# Altium schematic sheet S04-INTERFACES.SchDoc
size B; SheetNumber: 5; SheetTotal: 7; BLOCK-TITLE: RADIO/AUDIO MODULE INTERFACES; BLOCK-SIZE: B; BLOCK-PROJECT: MULTIMOD BASE; BLOCK-REVISION: 1; BLOCK-ORGANIZATION: UNIVERSITY OF FLORIDA; BLOCK-DESIGNER: MEHRON TALEBI; BLOCK-IDENTIFIER: SUMMER 2023; BLOCK-REVIEWER: MIKE STAPLETON
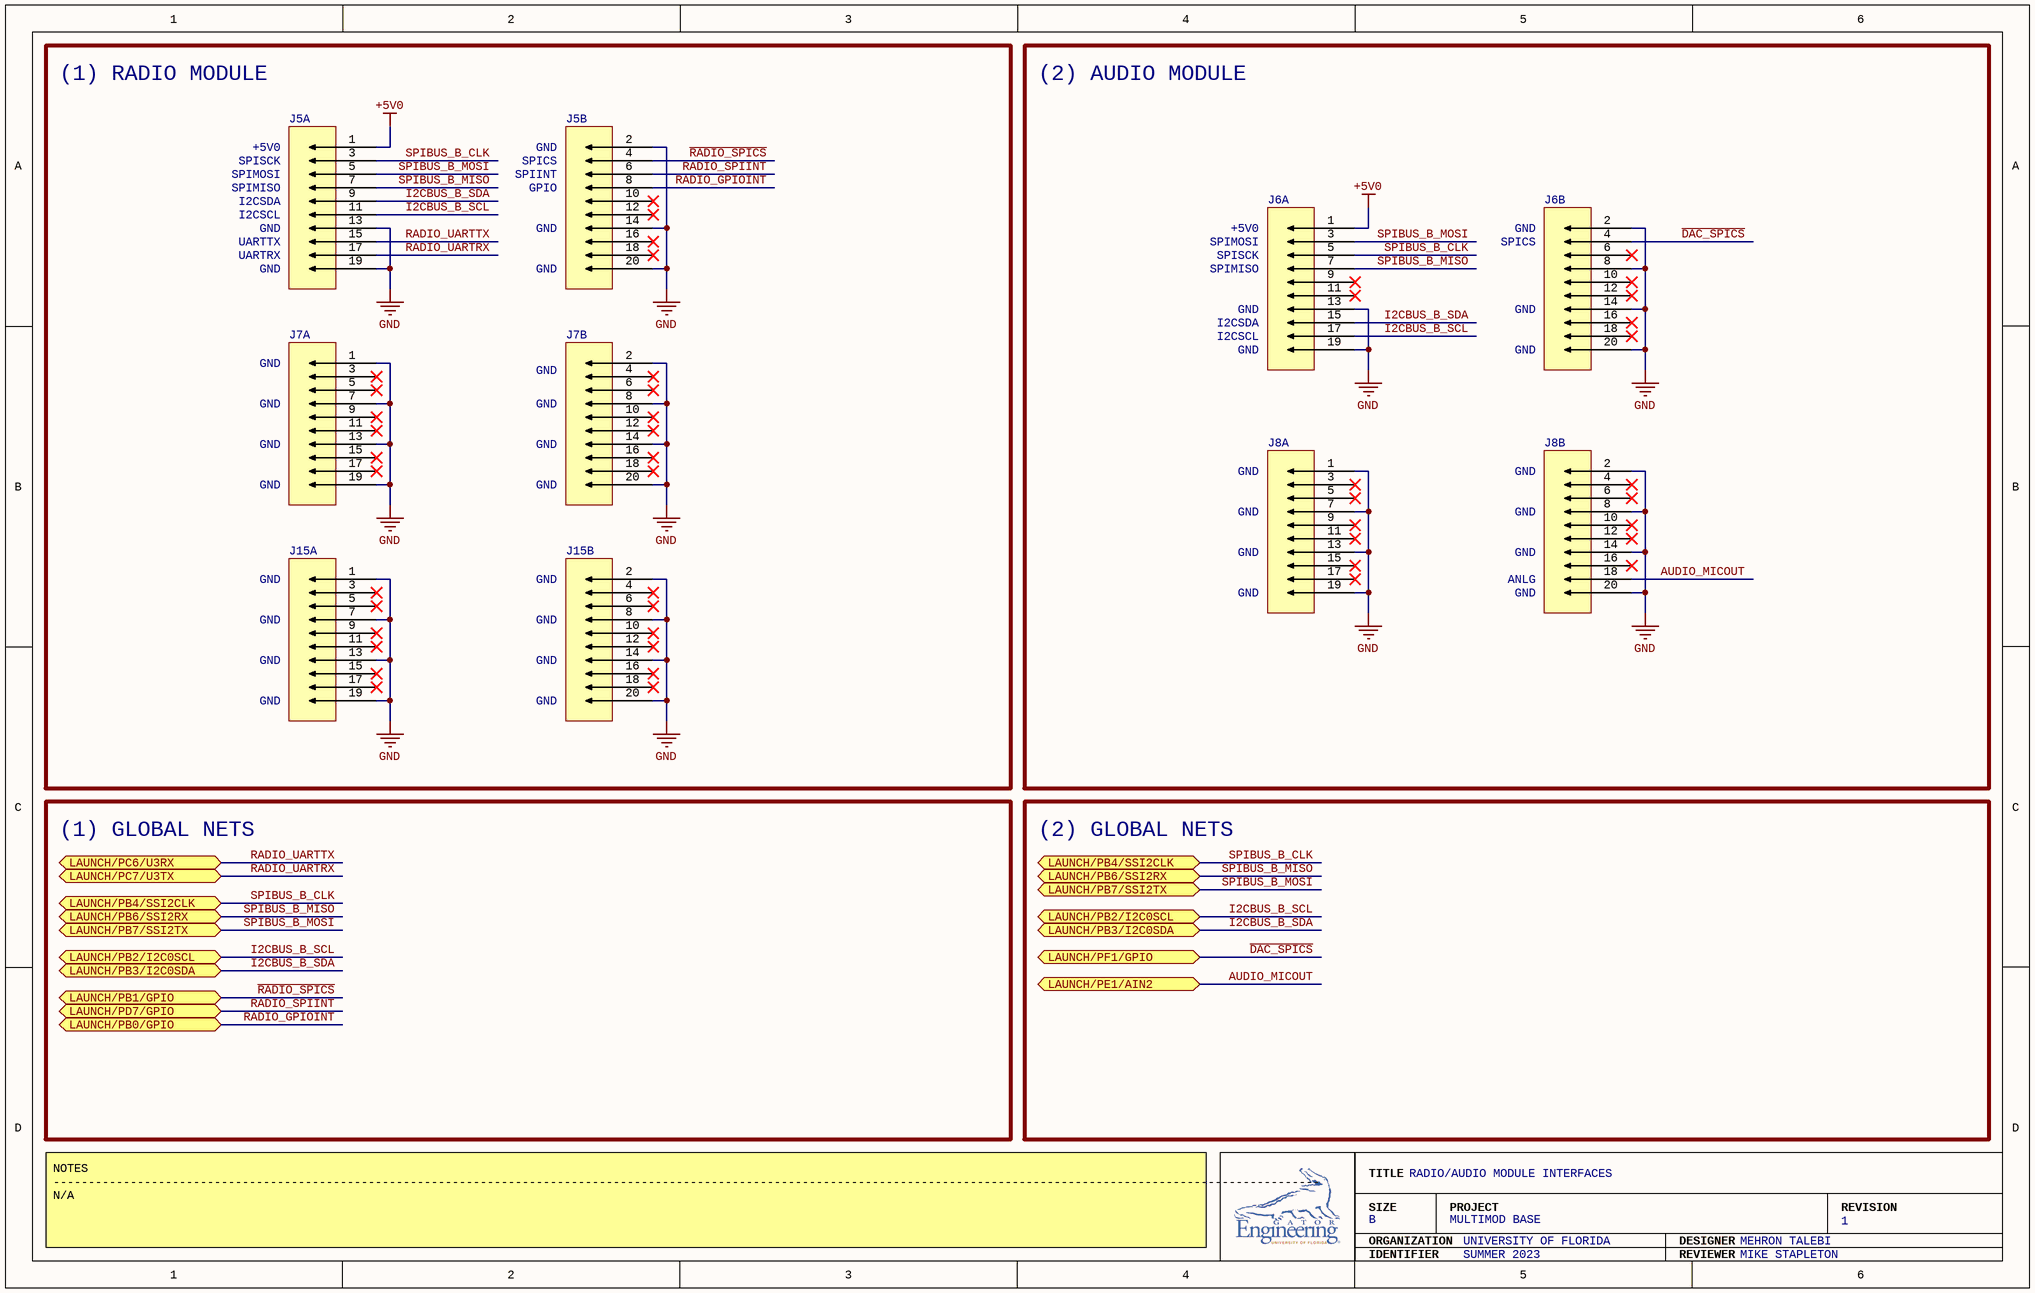
[diagram p0: S04-INTERFACES.SchDoc]

## Parts
J5  95278-101-20LF  [95278-101-20LF]  (value not drawn)  (parts A,B of 2)
J6  95278-101-20LF  [95278-101-20LF]  (value not drawn)  (parts A,B of 2)
J7  95278-101-20LF  [95278-101-20LF]  (value not drawn)  (parts A,B of 2)
J8  95278-101-20LF  [95278-101-20LF]  (value not drawn)  (parts A,B of 2)
J15  95278-101-20LF  [95278-101-20LF]  (value not drawn)  (parts A,B of 2)

## Blocks framed on the sheet
(1) RADIO MODULE: J5 J7 J15
(2) AUDIO MODULE: J6 J8

## Ports
LAUNCH/PB0/GPIO (bidir), LAUNCH/PB1/GPIO (bidir), LAUNCH/PB2/I2C0SCL (bidir), LAUNCH/PB3/I2C0SDA (bidir), LAUNCH/PB4/SSI2CLK (bidir), LAUNCH/PB6/SSI2RX (bidir), LAUNCH/PB7/SSI2TX (bidir), LAUNCH/PC6/U3RX (bidir), LAUNCH/PC7/U3TX (bidir), LAUNCH/PD7/GPIO (bidir), LAUNCH/PE1/AIN2 (bidir), LAUNCH/PF1/GPIO (bidir)

## Nets
+5V0: J5.1 J6.1
GND: J5.2 J5.13 J5.14 J5.19 J5.20 J6.2 J6.8 J6.13 J6.14 J6.19 J6.20 J7.1 J7.2 J7.7 J7.8 J7.13 J7.14 J7.19 J7.20 J8.1 J8.2 J8.7 J8.8 J8.13 J8.14 J8.19 J8.20 J15.1 J15.2 J15.7 J15.8 J15.13 J15.14 J15.19 J15.20
~{DAC_SPICS}: J6.4 ; port LAUNCH/PF1/GPIO
~{RADIO_SPICS}: J5.4 ; port LAUNCH/PB1/GPIO
AUDIO_MICOUT: J8.18 ; port LAUNCH/PE1/AIN2
I2CBUS_B_SCL: J5.11 J6.17 ; port LAUNCH/PB2/I2C0SCL
I2CBUS_B_SDA: J5.9 J6.15 ; port LAUNCH/PB3/I2C0SDA
RADIO_GPIOINT: J5.8 ; port LAUNCH/PB0/GPIO
RADIO_SPIINT: J5.6 ; port LAUNCH/PD7/GPIO
RADIO_UARTRX: J5.17 ; port LAUNCH/PC7/U3TX
RADIO_UARTTX: J5.15 ; port LAUNCH/PC6/U3RX
SPIBUS_B_CLK: J5.3 J6.5 ; port LAUNCH/PB4/SSI2CLK
SPIBUS_B_MISO: J5.7 J6.7 ; port LAUNCH/PB6/SSI2RX
SPIBUS_B_MOSI: J5.5 J6.3 ; port LAUNCH/PB7/SSI2TX

Not connected (* = marked no-connect by the designer): J5 10* 12* 16* 18*; J6 6* 9* 10* 11* 12* 16* 18*; J7 3* 4* 5* 6* 9* 10* 11* 12* 15* 16* 17* 18*; J8 3* 4* 5* 6* 9* 10* 11* 12* 15* 16* 17*; J15 3* 4* 5* 6* 9* 10* 11* 12* 15* 16* 17* 18*

## Notes on the sheet
- +5V0
- SPISCK
- SPICS
- GND
- SPIMOSI
- SPIMISO
- I2CSCL
- I2CSDA
- UARTTX
- SPIINT
- GPIO
- UARTRX
- ANLG
- (1) GLOBAL NETS
- (2) GLOBAL NETS
- NOTES
  -------------------------------------------------------------------------------------------------------------------------------------------------------------------------------------
  N/A
- TITLE
- SIZE
- ORGANIZATION
- PROJECT
- DESIGNER
- REVISION
- IDENTIFIER
- REVIEWER

## Library data of the parts
J5-J8 J15 = 95278-101-20LF: CONN HEADER SMD 20POS 2.54MM; Connector Type: Header, Breakaway; Pitch - Mating: 0.100" (2.54mm); Number of Positions: 20; Number of Positions Loaded: All; Style: Board to Board; Shrouding: Unshrouded; Contact Length - Mating: 0.232" (5.90mm); Material Flammability Rating: UL94 V-0; Current Rating (Amps): 3A per Contact; System: Connector; Contact Type: Male Pin; Number of Rows: 2; Row Spacing - Mating: 0.100" (2.54mm); Mounting Type: Surface Mount; Termination: Solder; Fastening Type: Push-Pull; Insulation Height: 0.100" (2.54mm); Contact Shape: Square; Contact Finish - Mating: Gold, GXT™; Contact Finish Thickness - Mating: 30.0µin (0.76µm); Contact Finish - Post: Tin; Contact Material: Phosphor Bronze; Insulation Material: Thermoplastic; Operating Temperature: -65°C ~ 125°C; Insulation Color: Black; Contact Finish Thickness - Post: 78.7µin (2.00µm); Supplier 1: Arrow Electronics; Supplier Part Number 1: 95278-101-20LF